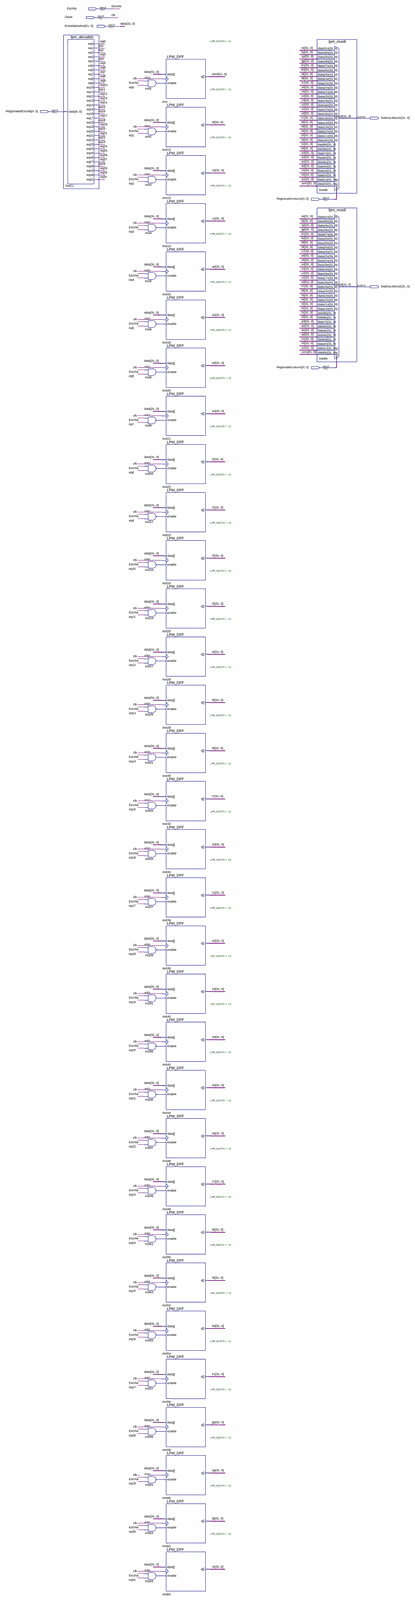
[diagram p0: schematic sheet, whole]
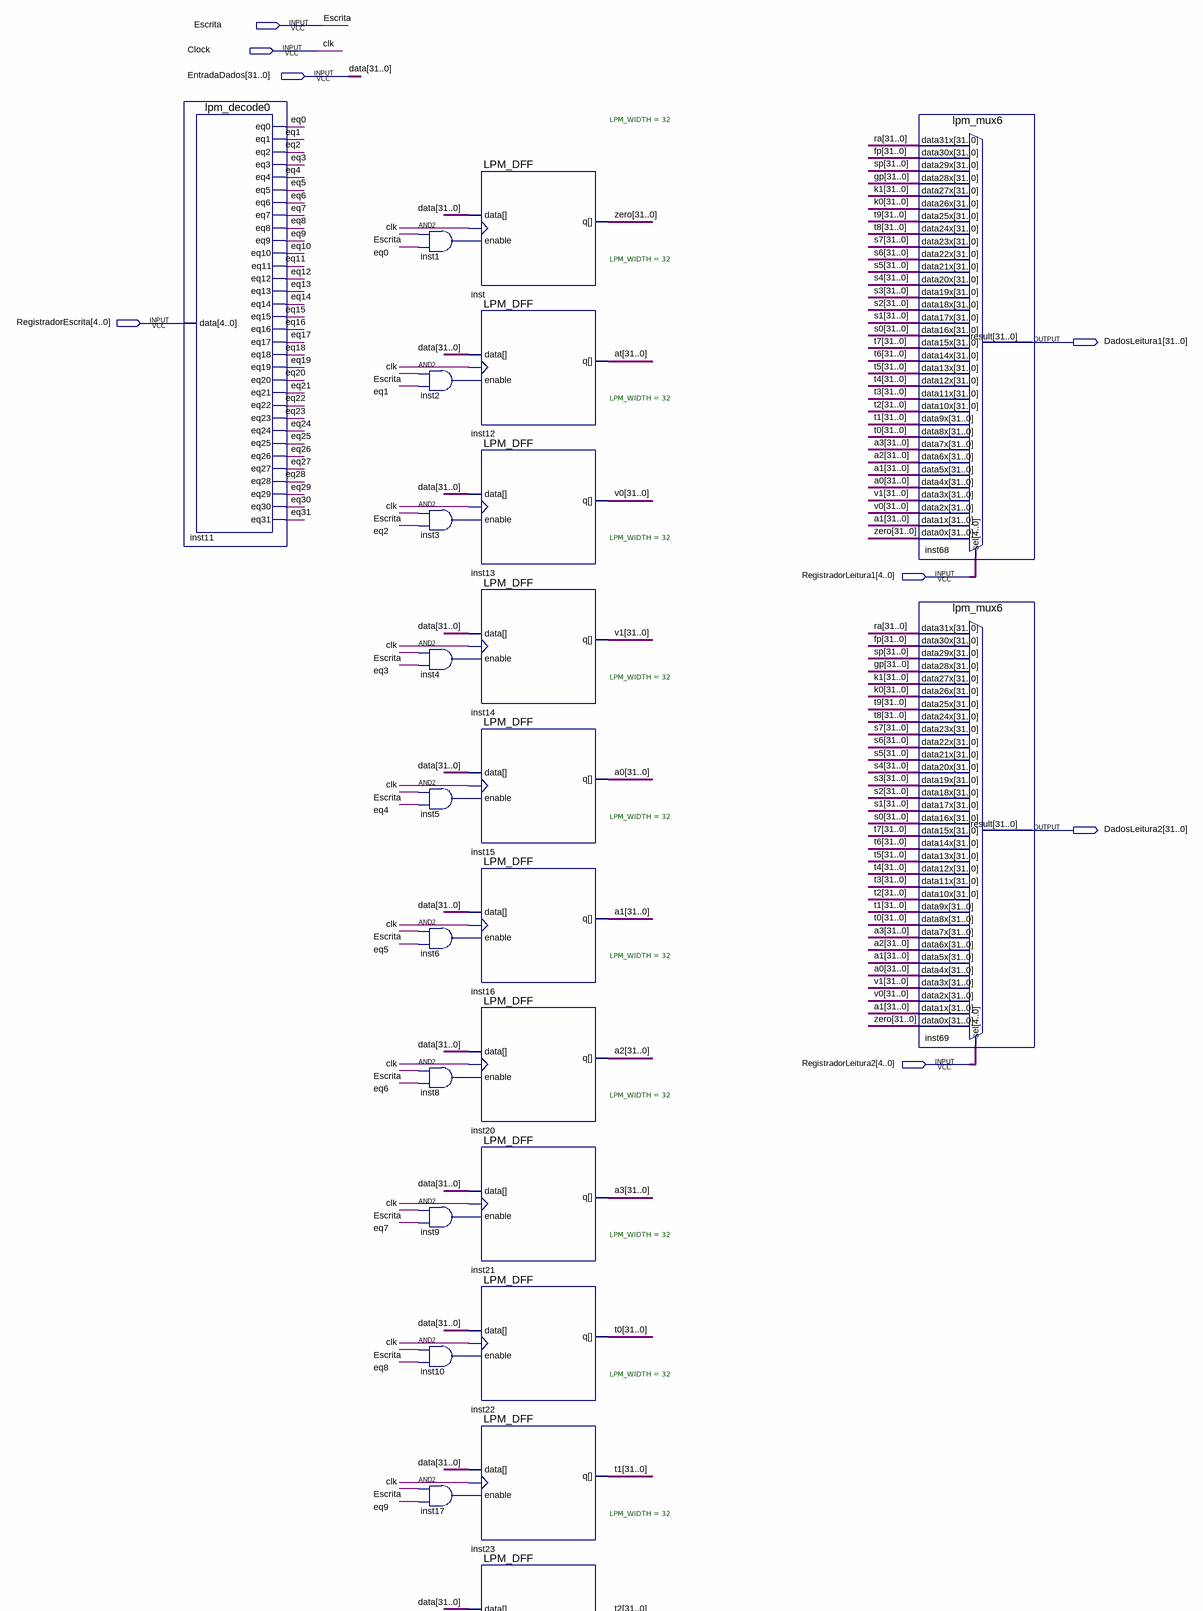
[diagram p1: schematic sheet, upper part]
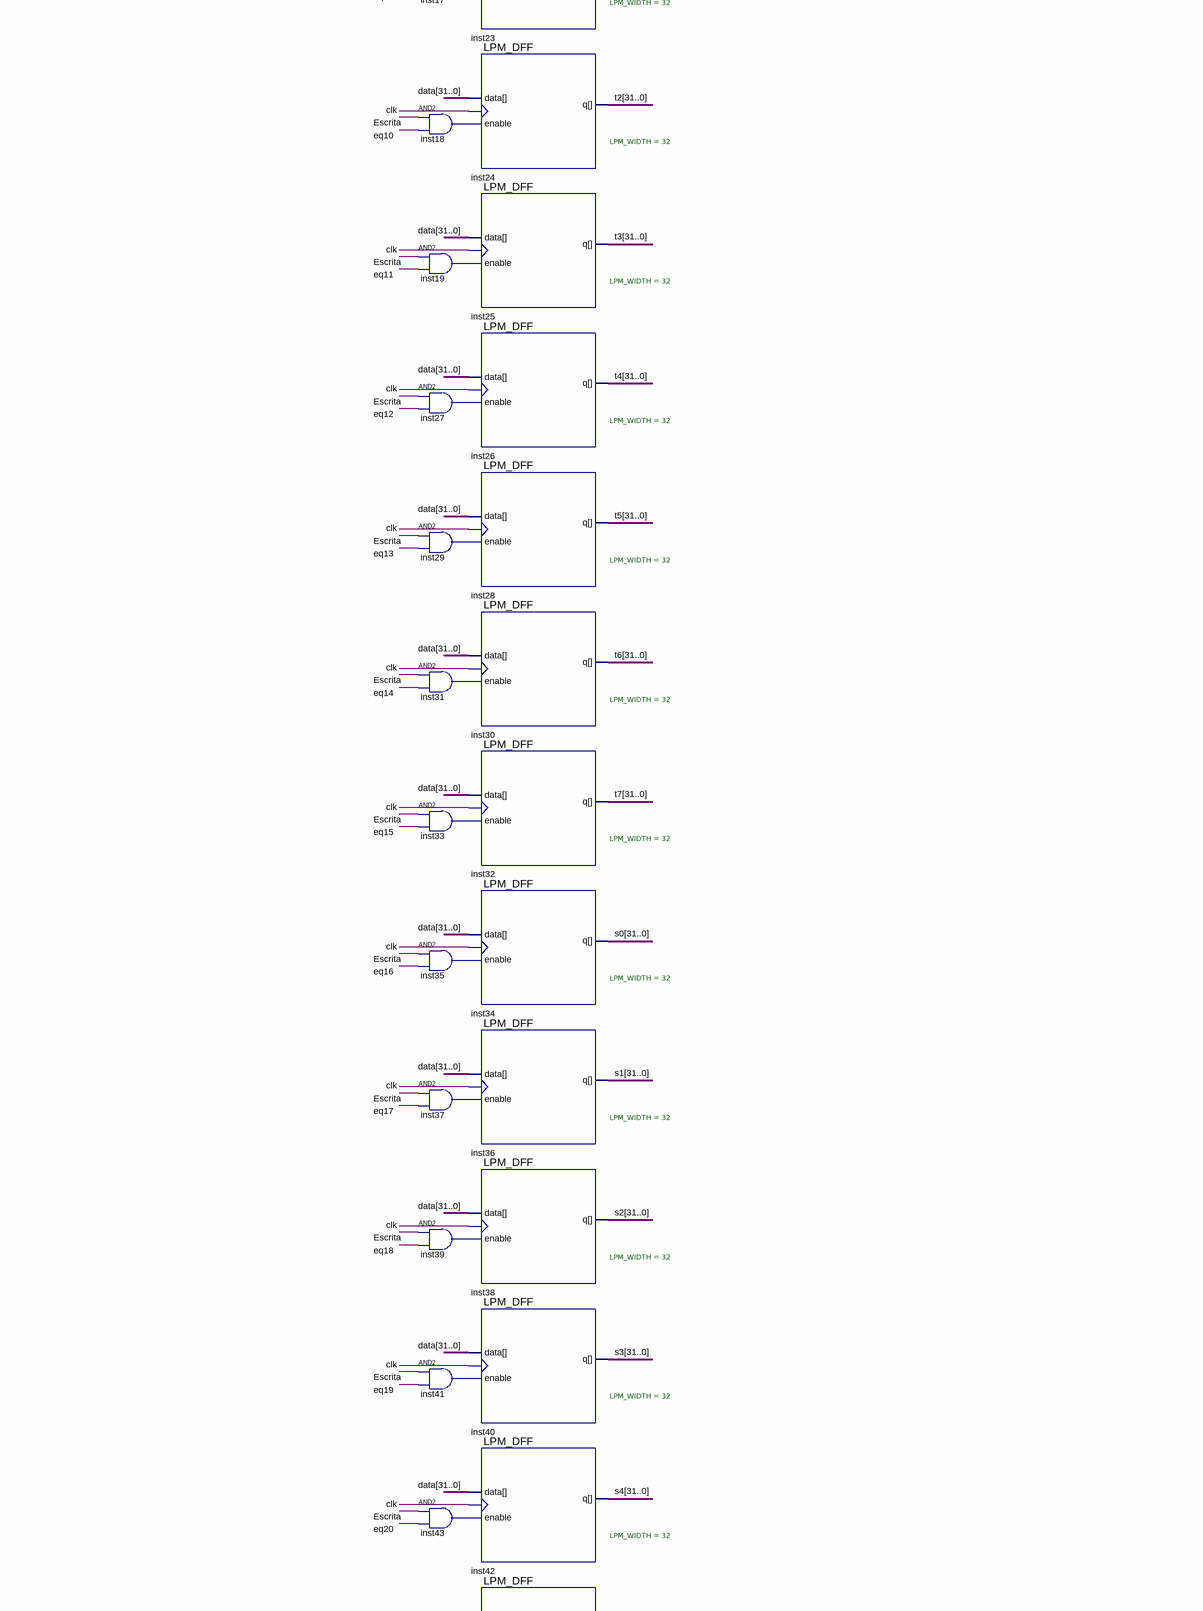
[diagram p2: schematic sheet, middle part]
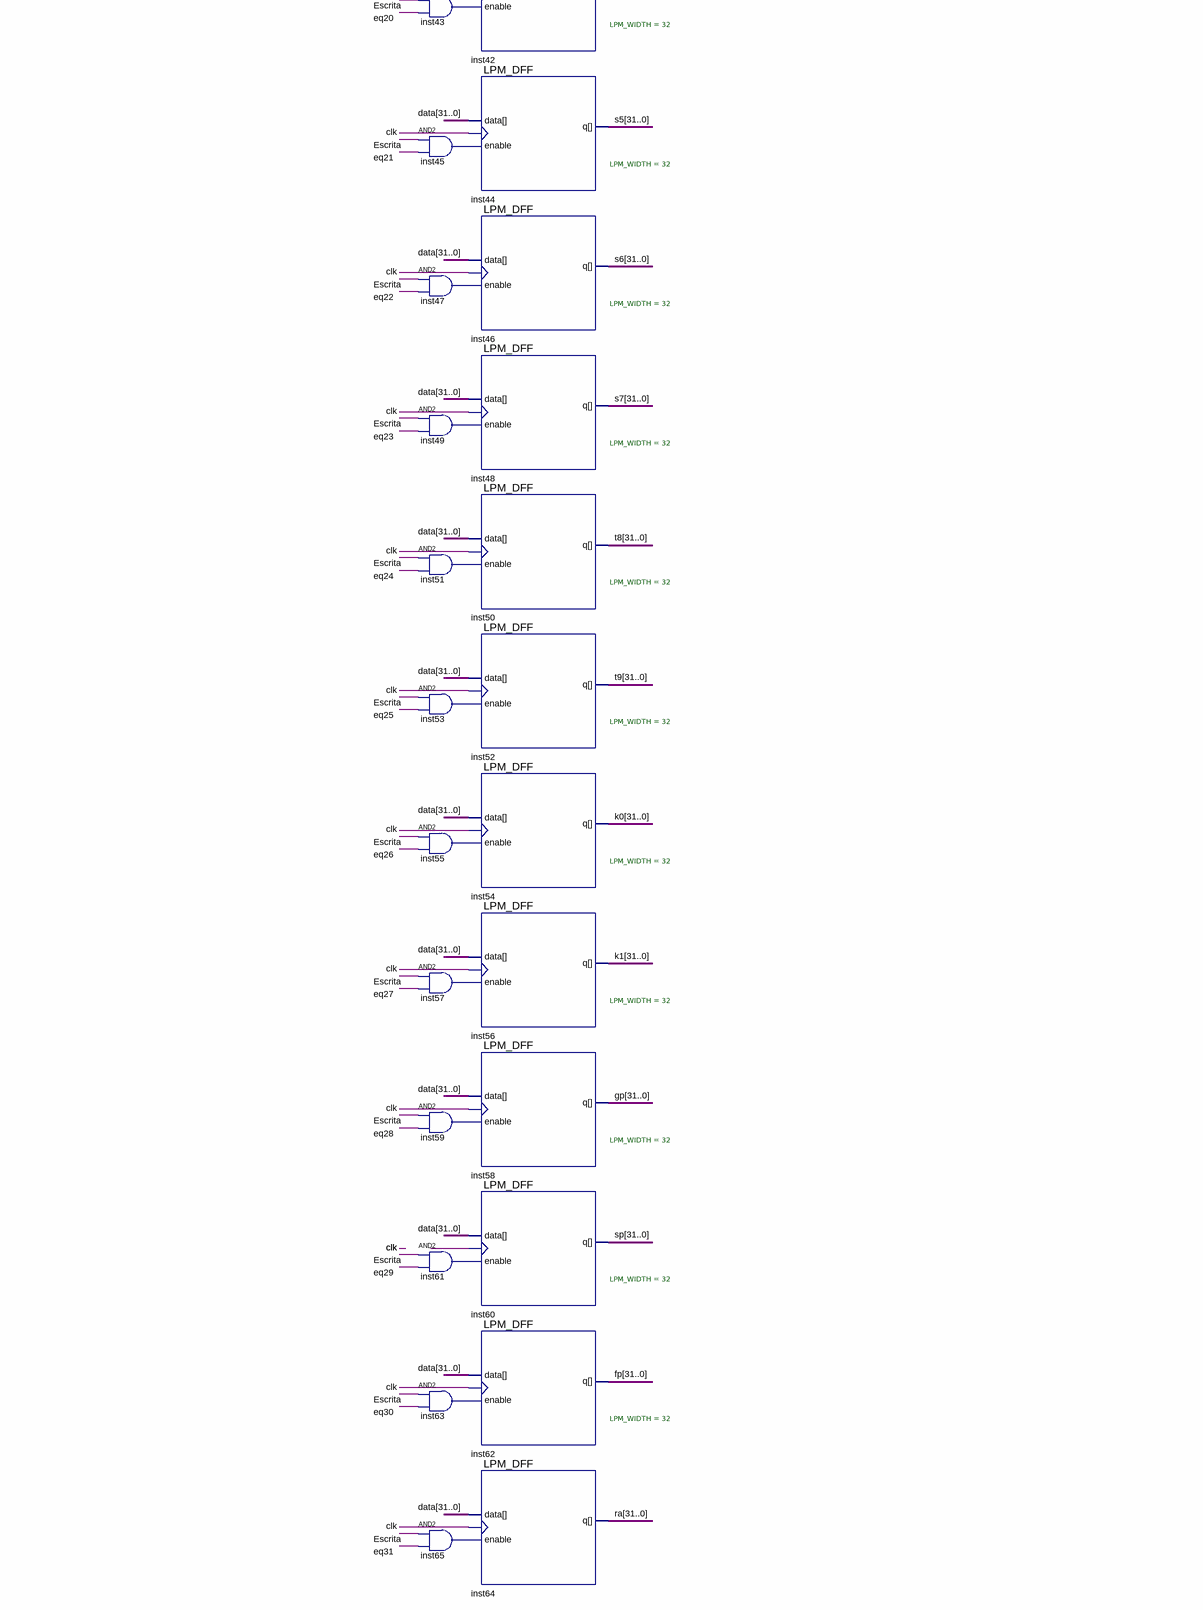
[diagram p3: schematic sheet, lower part]
// Quartus schematic BancoRegistradores.bdf as structural Verilog: 67 symbols, 8 pins
module BancoRegistradores (
  input  Escrita,
  input  Clock,
  input  [31:0] EntradaDados,
  input  [4:0] RegistradorEscrita,
  input  [4:0] RegistradorLeitura1,
  input  [4:0] RegistradorLeitura2,
  output [31:0] DadosLeitura1,
  output [31:0] DadosLeitura2
);

  wire eq0, eq1, eq2, eq3, eq4, eq5, eq6, eq7, eq8, eq9, eq10, eq11, eq12, eq13, eq14, eq15, eq16, eq17,
       eq18, eq19, eq20, eq21, eq22, eq23, eq24, eq25, eq26, eq27, eq28, eq29, eq30, eq31, inst1_out,
       inst2_out, inst3_out, inst4_out, inst5_out, inst6_out, inst8_out, inst9_out, inst10_out, inst17_out,
       inst18_out, inst19_out, inst27_out, inst29_out, inst31_out, inst33_out, inst35_out, inst37_out,
       inst39_out, inst41_out, inst43_out, inst45_out, inst47_out, inst49_out, inst51_out, inst53_out,
       inst55_out, inst57_out, inst59_out, inst61_out, inst63_out, inst65_out;
  wire [31:0] a0, a1, a2, a3, at, fp, gp, k0, k1, ra, s0, s1, s2, s3, s4, s5, s6, s7, sp, t0, t1, t2, t3, t4,
       t5, t6, t7, t8, t9, v0, v1, zero;

  lpm_decode0 inst11 (
    .data(RegistradorEscrita), .eq0(eq0), .eq1(eq1), .eq2(eq2), .eq3(eq3), .eq4(eq4), .eq5(eq5), .eq6(eq6),
    .eq7(eq7), .eq8(eq8), .eq9(eq9), .eq10(eq10), .eq11(eq11), .eq12(eq12), .eq13(eq13), .eq14(eq14),
    .eq15(eq15), .eq16(eq16), .eq17(eq17), .eq18(eq18), .eq19(eq19), .eq20(eq20), .eq21(eq21), .eq22(eq22),
    .eq23(eq23), .eq24(eq24), .eq25(eq25), .eq26(eq26), .eq27(eq27), .eq28(eq28), .eq29(eq29), .eq30(eq30),
    .eq31(eq31));
  and inst1 (inst1_out, Escrita, eq0);
  and inst2 (inst2_out, Escrita, eq1);
  and inst3 (inst3_out, Escrita, eq2);
  and inst4 (inst4_out, Escrita, eq3);
  and inst5 (inst5_out, Escrita, eq4);
  and inst6 (inst6_out, Escrita, eq5);
  and inst8 (inst8_out, Escrita, eq6);
  and inst9 (inst9_out, Escrita, eq7);
  and inst10 (inst10_out, Escrita, eq8);
  and inst17 (inst17_out, Escrita, eq9);
  and inst18 (inst18_out, Escrita, eq10);
  and inst19 (inst19_out, Escrita, eq11);
  and inst27 (inst27_out, Escrita, eq12);
  and inst29 (inst29_out, Escrita, eq13);
  and inst31 (inst31_out, Escrita, eq14);
  and inst33 (inst33_out, Escrita, eq15);
  and inst35 (inst35_out, Escrita, eq16);
  and inst37 (inst37_out, Escrita, eq17);
  and inst39 (inst39_out, Escrita, eq18);
  and inst41 (inst41_out, Escrita, eq19);
  and inst43 (inst43_out, Escrita, eq20);
  and inst45 (inst45_out, Escrita, eq21);
  and inst47 (inst47_out, Escrita, eq22);
  and inst49 (inst49_out, Escrita, eq23);
  and inst51 (inst51_out, Escrita, eq24);
  and inst53 (inst53_out, Escrita, eq25);
  and inst55 (inst55_out, Escrita, eq26);
  and inst57 (inst57_out, Escrita, eq27);
  and inst59 (inst59_out, Escrita, eq28);
  and inst61 (inst61_out, Escrita, eq29);
  and inst63 (inst63_out, Escrita, eq30);
  and inst65 (inst65_out, Escrita, eq31);
  LPM_DFF #(.LPM_WIDTH(32)) inst (.clock(Clock), .data(EntradaDados), .enable(inst1_out), .q(zero));
  LPM_DFF #(.LPM_WIDTH(32)) inst12 (.clock(Clock), .data(EntradaDados), .enable(inst2_out), .q(at));
  LPM_DFF #(.LPM_WIDTH(32)) inst13 (.clock(Clock), .data(EntradaDados), .enable(inst3_out), .q(v0));
  LPM_DFF #(.LPM_WIDTH(32)) inst14 (.clock(Clock), .data(EntradaDados), .enable(inst4_out), .q(v1));
  LPM_DFF #(.LPM_WIDTH(32)) inst15 (.clock(Clock), .data(EntradaDados), .enable(inst5_out), .q(a0));
  LPM_DFF #(.LPM_WIDTH(32)) inst16 (.clock(Clock), .data(EntradaDados), .enable(inst6_out), .q(a1));
  LPM_DFF #(.LPM_WIDTH(32)) inst20 (.clock(Clock), .data(EntradaDados), .enable(inst8_out), .q(a2));
  LPM_DFF #(.LPM_WIDTH(32)) inst21 (.clock(Clock), .data(EntradaDados), .enable(inst9_out), .q(a3));
  LPM_DFF #(.LPM_WIDTH(32)) inst22 (.clock(Clock), .data(EntradaDados), .enable(inst10_out), .q(t0));
  LPM_DFF #(.LPM_WIDTH(32)) inst23 (.clock(Clock), .data(EntradaDados), .enable(inst17_out), .q(t1));
  LPM_DFF #(.LPM_WIDTH(32)) inst24 (.clock(Clock), .data(EntradaDados), .enable(inst18_out), .q(t2));
  LPM_DFF #(.LPM_WIDTH(32)) inst25 (.clock(Clock), .data(EntradaDados), .enable(inst19_out), .q(t3));
  LPM_DFF #(.LPM_WIDTH(32)) inst26 (.clock(Clock), .data(EntradaDados), .enable(inst27_out), .q(t4));
  LPM_DFF #(.LPM_WIDTH(32)) inst28 (.clock(Clock), .data(EntradaDados), .enable(inst29_out), .q(t5));
  LPM_DFF #(.LPM_WIDTH(32)) inst30 (.clock(Clock), .data(EntradaDados), .enable(inst31_out), .q(t6));
  LPM_DFF #(.LPM_WIDTH(32)) inst32 (.clock(Clock), .data(EntradaDados), .enable(inst33_out), .q(t7));
  LPM_DFF #(.LPM_WIDTH(32)) inst34 (.clock(Clock), .data(EntradaDados), .enable(inst35_out), .q(s0));
  LPM_DFF #(.LPM_WIDTH(32)) inst36 (.clock(Clock), .data(EntradaDados), .enable(inst37_out), .q(s1));
  LPM_DFF #(.LPM_WIDTH(32)) inst38 (.clock(Clock), .data(EntradaDados), .enable(inst39_out), .q(s2));
  LPM_DFF #(.LPM_WIDTH(32)) inst40 (.clock(Clock), .data(EntradaDados), .enable(inst41_out), .q(s3));
  LPM_DFF #(.LPM_WIDTH(32)) inst42 (.clock(Clock), .data(EntradaDados), .enable(inst43_out), .q(s4));
  LPM_DFF #(.LPM_WIDTH(32)) inst44 (.clock(Clock), .data(EntradaDados), .enable(inst45_out), .q(s5));
  LPM_DFF #(.LPM_WIDTH(32)) inst46 (.clock(Clock), .data(EntradaDados), .enable(inst47_out), .q(s6));
  LPM_DFF #(.LPM_WIDTH(32)) inst48 (.clock(Clock), .data(EntradaDados), .enable(inst49_out), .q(s7));
  LPM_DFF #(.LPM_WIDTH(32)) inst50 (.clock(Clock), .data(EntradaDados), .enable(inst51_out), .q(t8));
  LPM_DFF #(.LPM_WIDTH(32)) inst52 (.clock(Clock), .data(EntradaDados), .enable(inst53_out), .q(t9));
  LPM_DFF #(.LPM_WIDTH(32)) inst54 (.clock(Clock), .data(EntradaDados), .enable(inst55_out), .q(k0));
  LPM_DFF #(.LPM_WIDTH(32)) inst56 (.clock(Clock), .data(EntradaDados), .enable(inst57_out), .q(k1));
  LPM_DFF #(.LPM_WIDTH(32)) inst58 (.clock(Clock), .data(EntradaDados), .enable(inst59_out), .q(gp));
  LPM_DFF #(.LPM_WIDTH(32)) inst60 (.clock(Clock), .data(EntradaDados), .enable(inst61_out), .q(sp));
  LPM_DFF #(.LPM_WIDTH(32)) inst62 (.clock(Clock), .data(EntradaDados), .enable(inst63_out), .q(fp));
  LPM_DFF #(.LPM_WIDTH(32)) inst64 (.clock(Clock), .data(EntradaDados), .enable(inst65_out), .q(ra));
  lpm_mux6 inst68 (
    .data31x(ra), .data30x(fp), .data29x(sp), .data28x(gp), .data27x(k1), .data26x(k0), .data25x(t9),
    .data24x(t8), .data23x(s7), .data22x(s6), .data21x(s5), .data20x(s4), .data19x(s3), .data18x(s2),
    .data17x(s1), .data16x(s0), .data15x(t7), .data14x(t6), .data13x(t5), .data12x(t4), .data11x(t3),
    .data10x(t2), .data9x(t1), .data8x(t0), .data7x(a3), .data6x(a2), .data5x(a1), .data4x(a0), .data3x(v1),
    .data2x(v0), .data1x(a1), .data0x(zero), .sel(RegistradorLeitura1), .result(DadosLeitura1));
  lpm_mux6 inst69 (
    .data31x(ra), .data30x(fp), .data29x(sp), .data28x(gp), .data27x(k1), .data26x(k0), .data25x(t9),
    .data24x(t8), .data23x(s7), .data22x(s6), .data21x(s5), .data20x(s4), .data19x(s3), .data18x(s2),
    .data17x(s1), .data16x(s0), .data15x(t7), .data14x(t6), .data13x(t5), .data12x(t4), .data11x(t3),
    .data10x(t2), .data9x(t1), .data8x(t0), .data7x(a3), .data6x(a2), .data5x(a1), .data4x(a0), .data3x(v1),
    .data2x(v0), .data1x(a1), .data0x(zero), .sel(RegistradorLeitura2), .result(DadosLeitura2));

  // Other names for the same wires on the sheet: clk = Clock; data[31:0] = EntradaDados
endmodule
